# Altium schematic sheet L5970D.SchDoc
size A4
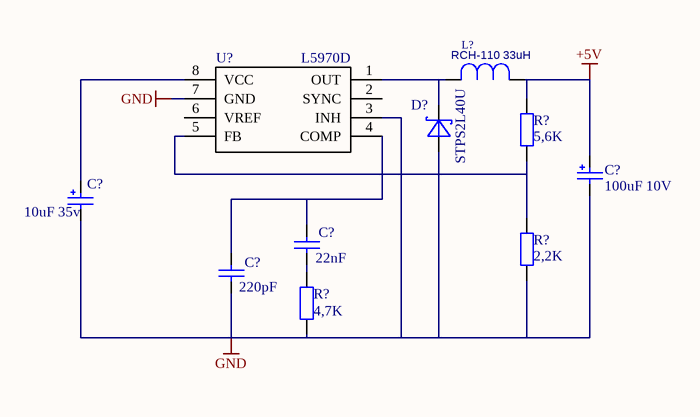
[diagram p0: L5970D.SchDoc]

## Parts
(Parts that share a designator on the sheet are numbered #1, #2 ... from top to bottom, then left to right.)
C?#1  value 100uF 10V  [10x16]  (hidden comment: Cap_Polar)
C?#2  value 10uF 35v  [10x16]  (hidden comment: Cap_Polar)
C?#3  value 22nF  [C_0805]  (hidden comment: Cap_Semi)
C?#4  value 220pF  [C_0805]  (hidden comment: Cap_Semi)
D?  STPS2L40U  [DO-214AA]
L?  RCH-110 33uH  [RCH-110]
R?#1  value 5,6K  [R_1206]  (hidden comment: Resistor 1206)
R?#2  value 2,2K  [R_1206]  (hidden comment: Resistor 1206)
R?#3  value 4,7K  [R_1206]  (hidden comment: Resistor 1206)
U?  L5970D  [SO-8_N]

## Nets
+5V: C?#1.1 L?.1 R?#1.1
GND: C?#1.2 C?#2.2 C?#4.2 D?.1(A) R?#2.2 R?#3.1 U?.3(INH) U?.7(GND)
NetC?#2_1: C?#2.1 U?.8(VCC)
NetC?#3_1: C?#3.1 C?#4.1 U?.4(COMP)
NetC?#3_2: C?#3.2 R?#3.2
NetD?_2: D?.2(C) L?.2 U?.1(OUT)
NetR?#1_2: R?#1.2 R?#2.1 U?.5(FB)

Not connected (* = marked no-connect by the designer): U? 2(SYNC) 6(VREF)

## Library data of the parts
C?#1 C?#2 = Cap_Polar: Capacitor Polar
C?#3 C?#4 = Cap_Semi: Capacitor Semi
D? = STPS2L40U: Диод шотки; Разработал: Сергеев
L? = Inductor: Value: RCH-110 33uH
U? = L5970D: Up to 1A step down switching regulator